# Altium schematic sheet TIDA-PowerNB_BuckBoost.SchDoc
size A3; Date: Not shown in title block; ApprovedBy: Not shown in title block; CheckedBy: Not shown in title block; Author: Not shown in title block; CompanyName: Not shown in title block; DrawnBy: Julian Hagedorn; Engineer: Not shown in title block; Organization: Not shown in title block; Address1: Not shown in title block; Address2: Not shown in title block; Address3: Not shown in title block; Address4: Not shown in title block; DocumentNumber: 1; Revision: Use project parameter SCH_Rev; SheetNumber: 1; SheetTotal: 2; PageSetup: Record=PageOptions|CenterHorizontal=True|CenterVertical=True|PrintScale=1.00|XCorrection=1.00|YCorrection=1.00|PrintKind=0|BorderSize=5000000|LeftOffset=0|BottomOffset=0|Orientation=2|PaperLength=1000|PaperWidth=1000|Scale=100|PaperSource=15|PrintQuality=600|MediaType=1|DitherType=10|PaperKind=Letter|PrintScaleMode=1; CurrentTime: Not shown in title block; CurrentDate: Not shown in title block; Time: Not shown in title block; DocumentFullPathAndName: Not shown in title block; DocumentName: Not shown in title block; ModifiedDate: Not shown in title block; ImagePath: Not shown in title block
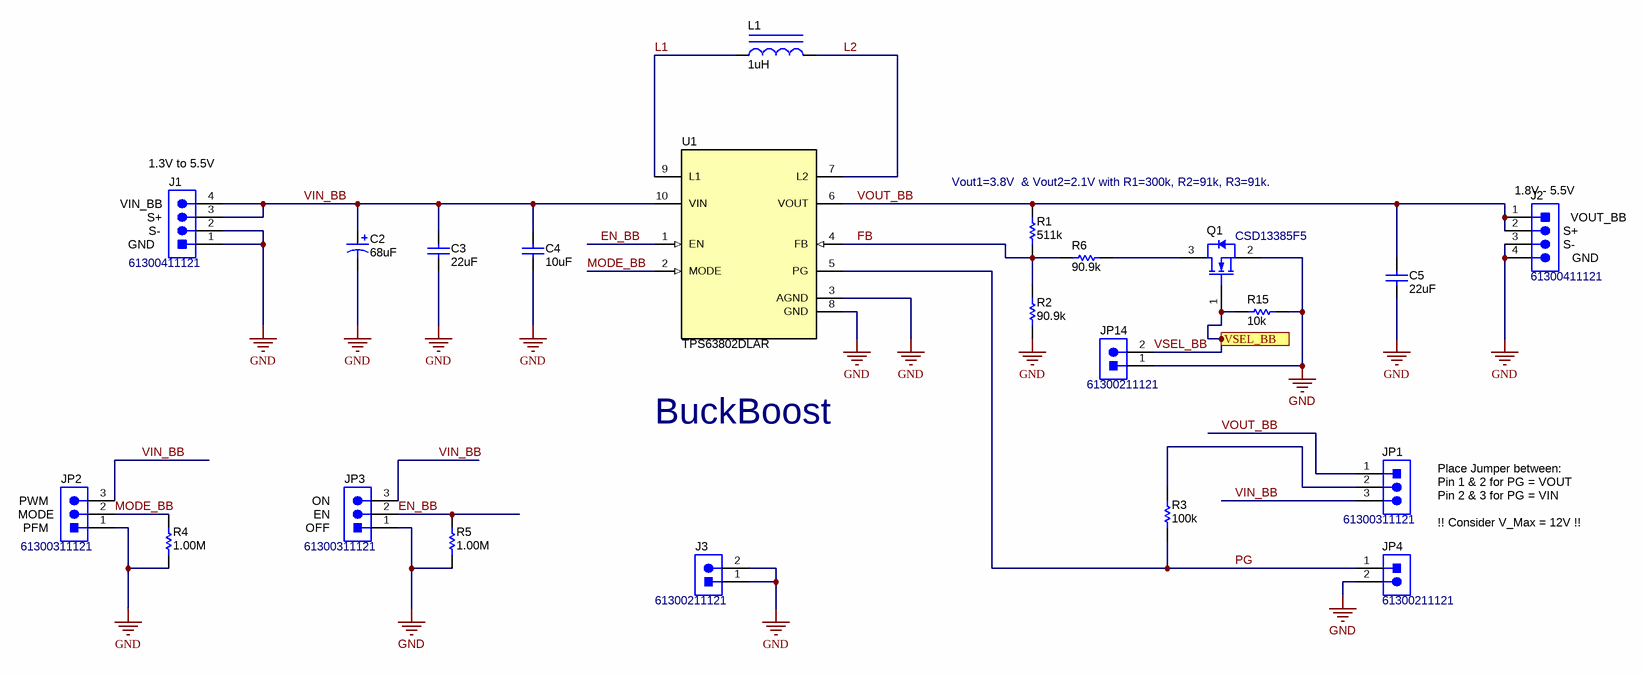
[diagram p0: TIDA-PowerNB_BuckBoost.SchDoc]

## Parts
C2  ValueDisplayed: 68uF  [7343-31]  (hidden comment: Cap_Polarized)
C3  ValueDisplayed: 22uF  [1206_190]  (hidden comment: Capacitor)
C4  ValueDisplayed: 10uF  [0603S]  (hidden comment: Capacitor)
C5  ValueDisplayed: 22uF  [0603S]  (hidden comment: Capacitor)
J1  61300411121  [WURTH_61300411121]
J2  61300411121  [WURTH_61300411121]
J3  61300211121  [WURTH_61300211121]
JP1  61300311121  [WURTH_61300311121]
JP2  61300311121  [WURTH_61300311121]
JP3  61300311121  [WURTH_61300311121]
JP4  61300211121  [WURTH_61300211121]
JP14  61300211121  [WURTH_61300211121]
L1  ValueDisplayed: 1uH  [WE-MAPI_4020]  (hidden comment: 74438356010)
Q1  CSD13385F5  [YJK0003A]
R1  ValueDisplayed: 511k  [0402]  (hidden comment: CRCW0402511KFKED)
R2  ValueDisplayed: 90.9k  [0402]  (hidden comment: CRCW040290K9FKED)
R3  ValueDisplayed: 100k  [0402]  (hidden comment: RC0402FR-07100KL)
R4  ValueDisplayed: 1.00M  [0402]  (hidden comment: CRCW04021M00FKED)
R5  ValueDisplayed: 1.00M  [0402]  (hidden comment: CRCW04021M00FKED)
R6  ValueDisplayed: 90.9k  [0402]  (hidden comment: CRCW040290K9FKED)
R15  Res_ohm: 10k  [0402]  (hidden comment: ERJ-2RKF1002X)
U1  TPS63802DLAR  [DLA0010A]

## Ports
VSEL_BB

## Nets
GND: C2.2(-) C3.2 C4.2 C5.2 J1.1 J1.2 J2.3 J2.4 J3.1 J3.2 JP2.1 JP3.1 JP4.2 JP14.1 Q1.2(S) R2.1 R4.1 R5.1 R15.1 U1.3(AGND) U1.8(GND)
EN_BB: JP3.2 R5.2 U1.1(EN)
FB: R1.1 R2.2 R6.2 U1.4(FB)
L1: L1.1 U1.9(L1)
L2: L1.2 U1.7(L2)
MODE_BB: JP2.2 R4.2 U1.2(MODE)
PG: JP4.1 R3.1 U1.5(PG)
VIN_BB: C2.1(+) C3.1 C4.1 J1.3 J1.4 JP1.3 JP2.3 JP3.3 U1.10(VIN)
VOUT_BB: C5.1 J2.1 J2.2 JP1.1 R1.2 U1.6(VOUT)
VSEL_BB: JP14.2 Q1.1(G) R15.2 ; port VSEL_BB
NetJP1_2: JP1.2 R3.2
NetQ1_3: Q1.3(D) R6.1

## Notes on the sheet
- (near J1) 1.3V to 5.5V
- (near J1) VIN_BB
- (near J1) S+
- (near J1) S-
- (near R1) Vout1=3.8V  & Vout2=2.1V with R1=300k, R2=91k, R3=91k.
- (near J2) 1.8V - 5.5V
- (near J2) S+
- (near J2) VOUT_BB
- (near J1) GND
- (near J2) S-
- (near J2) GND
- BuckBoost
- (near JP2) PWM
- (near JP3) ON
- (near JP2) PFM
- (near JP2) MODE
- (near JP3) OFF
- (near JP3) EN
- Place Jumper between:
  Pin 1 & 2 for PG = VOUT
  Pin 2 & 3 for PG = VIN
  !! Consider V_Max = 12V !!
- Drawn By:
- SVN Rev:
- Number:
- TID #:
- Orderable:
- Rev:
- Sheet Title:
- File:
- Project Title:
- Designed for:
- Assembly Variant:
- Mod. Date:
- Sheet:
- Size:
- of
- A3
- http://www.ti.com
- Texas Instruments and/or its licensors do not warrant the accuracy or completeness of this specification or any information contained therein. Texas Instruments and/or its licensors do not warrant that this design will meet the specifications, will be suitable for your application or fit for any particular purpose, or will operate in an implementation. Texas Instruments and/or its licensors do not warrant that the design is production worthy. You should completely validate and test your design implementation to confirm the system functionality for your application.
- Engineer:
- Contact:
- © Texas Instruments

## Library data of the parts
C2 = CMP-0011790-2: CAP, TA, 68 uF, 20 V, +/- 10%, 0.15 ohm, SMD; PartNumber: T495D686K020ATE150; Manufacturer: Kemet; Polarized: Y; CompType: Capacitor; Value: 68uF; U/M: EA; Cap_F: 68µF; VDC_V: 20V; ESR_ohm: 1.5d; IRMS_A: 9dA; TaMin_C: -55°C; TaMax_C: 125°C; Cap_Case: D; AEC Category: Q200; SizeArea_mm2: 31.39; SizeAreaWB_mm2: 58.59; SizeX_mm: 7.3; SizeY_mm: 4.3; SizeZ_mm: 3.1; PackageReference: 7343-31; RoHS: Y; Tolerance_%: 10%; Value1: 0.15 ohm; Value2: 20V; MountType: SMT; Technology: TA; Series: T495; Publisher: Texas Instruments; LatestRevisionDate: 2017-03-09; LatestRevisionNote: Updated supplier links; ComponentLink1Description: Datasheet link; ComponentLink1URL: http://www.kemet.com/Lists/ProductCatalog/Attachments/261/KEM_T2009_T495.pdf; Supplier 1: Digi-Key; Supplier Part Number 1: 399-3890-1-ND; Supplier 2: Newark; Supplier Part Number 2: 40K1101; Supplier 3: Mouser; Supplier Part Number 3: 80-T495D686K20ATE150; AEC Qualified: ?
C3 = CMP-0009024-2: CAP, CERM, 22 uF, 25 V, +/- 20%, X5R, 1206_190; PartNumber: TMK316BBJ226ML-T; Manufacturer: Taiyo Yuden; Polarized: N; Value: 22uF; U/M: EA; Cap_F: 22µF; Value1: Unknown; VDC_V: 25V; TaMin_C: -55°C; TaMax_C: 85°C; Cap_Case: 1206; AEC Category: Q200; SizeArea_mm2: 5.12; SizeAreaWB_mm2: 10.92; SizeX_mm: 3.2; SizeY_mm: 1.6; SizeZ_mm: 1.9; CompType: Capacitor; PackageReference: 1206_190; RoHS: Y; Tolerance_%: 20%; Value2: 25V; MountType: SMT; Technology: Ceramic; TempCo: X5R; Published: 2008-06-19; Publisher: Texas Instruments; LatestRevisionDate: 2017-03-09; ComponentLink1Description: Datasheet link; ComponentLink1URL: http://www.yuden.co.jp/productdata/catalog/en/mlcc_all_e.pdf; Supplier 1: Digi-Key; Supplier Part Number 1: 587-3246-1-ND; Supplier 2: Newark; Supplier Part Number 2: 29X1397; Supplier 3: Mouser; Supplier Part Number 3: 963-TMK316BBJ226ML-T; AEC Grade: N/A; AEC Qualified: N
C4 = CMP-0007304-5: CAP, CERM, 10 uF, 6.3 V, +/- 20%, X5R, 0603; PartNumber: GRM188R60J106ME84; Manufacturer: MuRata; Polarized: N; Value: 10uF; U/M: EA; Cap_F: 10µF; Value1: Unknown; VDC_V: 6.3V; TaMin_C: -55°C; TaMax_C: 85°C; Cap_Case: 0603; SizeArea_mm2: 1.28; SizeAreaWB_mm2: 4.68; SizeX_mm: 1.6; SizeY_mm: 0.8; SizeZ_mm: 1; AEC Category: Q200; CompType: Capacitor; PackageReference: 0603; RoHS: Y; Tolerance_%: 20%; Value2: 6.3V; MountType: SMT; Technology: Ceramic; TempCo: X5R; Published: 2008-06-19; Publisher: Texas Instruments; LatestRevisionDate: 2017-03-09; ComponentLink1Description: Datasheet link; ComponentLink1URL: http://search.murata.co.jp/Ceramy/image/img/A01X/G101/ENG/GRM188R60J106ME84-01.pdf; Supplier 1: Digi-Key; Supplier Part Number 1: 490-7316-1-ND; AEC Qualified: ?
C5 = CMP-0007306-5: CAP, CERM, 22 uF, 6.3 V, +/- 20%, X5R, 0603; PartNumber: GRM188R60J226MEA0D; Manufacturer: MuRata; Polarized: N; Value: 22uF; U/M: EA; Cap_F: 22µF; Value1: Unknown; VDC_V: 6.3V; TaMin_C: -55°C; TaMax_C: 85°C; Cap_Case: 0603; SizeArea_mm2: 1.28; SizeAreaWB_mm2: 4.68; SizeX_mm: 1.6; SizeY_mm: 0.8; SizeZ_mm: 1; AEC Category: Q200; CompType: Capacitor; PackageReference: 0603; RoHS: Y; Tolerance_%: 20%; Value2: 6.3V; MountType: SMT; Technology: Ceramic; TempCo: X5R; Published: 2008-06-19; Publisher: Texas Instruments; LatestRevisionDate: 2017-03-09; ComponentLink1Description: Datasheet link; ComponentLink1URL: http://search.murata.co.jp/Ceramy/image/img/A01X/G101/ENG/GRM188R60J226MEA0-01.pdf; Supplier 1: Digi-Key; Supplier Part Number 1: 490-7611-1-ND; Supplier 2: Newark; Supplier Part Number 2: 55Y9854; Supplier 3: Mouser; Supplier Part Number 3: 81-GRM188R60J226ME0D; AEC Qualified: N; AEC Grade: N/A
J1 J2 = CMP-0054798-2: Header, 2.54 mm, 4x1, Gold, TH; Manufacturer: Wurth Elektronik; Pitch_mm: 2.54; Gender: Male; Row_Count: 1; Cert_UL: Y; Shrouded: N; Supplier Part Number 3: 2356155; ClassName: Header; MountType: TH; ComponentLink1Description: Datasheet URL; PartNumber: 61300411121; PackageReference: Header, 2.54mm, 4x1, TH; Color: Black; Supplier 3: Farnell; Supplier Part Number 1: 732-5317-ND; Supplier 2: Newark; ComponentLink1URL: http://katalog.we-online.de/em/datasheet/6130xx11121.pdf; CompType: Header; PinCount: 4; Supplier 1: Digi-Key; RoHS: Y; ContactFinish: Gold; Supplier Part Number 2: 20X0951; Orientation: Vertical
J3 JP4 JP14 = CMP-0054794-2: Header, 2.54 mm, 2x1, Gold, TH; Manufacturer: Wurth Elektronik; Shrouded: N; Gender: Male; Green_REACh: Passed; Pitch_mm: 2.54; Green_Lifecycle: Active; Row_Count: 1; Cert_UL: Y; Supplier Part Number 2: 20X0948; Orientation: Vertical; PinCount: 2; ClassName: Header; Supplier 2: Newark; PackageReference: Header, 2.54mm, 2x1, TH; CompType: Header; ComponentLink1Description: Datasheet URL; Supplier 1: Digi-Key; Green_EU RoHS-2: Incomplete; ComponentLink1URL: http://katalog.we-online.de/em/datasheet/6130xx11121.pdf; Green_EU RoHS: Passed; MountType: TH; Supplier Part Number 3: 710-61300211121; RoHS: Y; Supplier Part Number 1: 732-5315-ND; ContactFinish: Gold; Supplier 3: Mouser; PartNumber: 61300211121; Color: Black
JP1-JP3 = CMP-0054796-2: Header, 2.54 mm, 3x1, Gold, TH; Manufacturer: Wurth Elektronik; Pitch_mm: 2.54; Green_Lifecycle: Active; Cert_UL: Y; Shrouded: N; Green_REACh: Passed; Gender: Male; Row_Count: 1; MountType: TH; Supplier Part Number 1: 732-5316-ND; PinCount: 3; Color: Black; ClassName: Header; Supplier Part Number 3: 356154; ContactFinish: Gold; ComponentLink1Description: Datasheet URL; ComponentLink1URL: http://katalog.we-online.de/em/datasheet/6130xx11121.pdf; PackageReference: Header, 2.54mm, 3x1, TH; Supplier Part Number 2: 20X0950; Green_EU RoHS-2: Incomplete; CompType: Header; Green_EU RoHS: Passed; Orientation: Vertical; RoHS: Y; PartNumber: 61300311121; Supplier 2: Newark; Supplier 1: Digi-Key; Supplier 3: Farnell
L1 = CMP-0064168-1: Inductor, Shielded, 1 uH, 7.2 A, 0.012 ohm, SMD; Manufacturer: Wurth Elektronik; Isat: 9A @ 20% inductance drop; Irms: 7.2A @ 40C rise; Green_Lifecycle: Active; SizeAreaWB_mm2: 26.01; DCR_ohm: 0.012; Green_REACh: Passed; Value: 1uH; Imax_A: 7.2A; SizeZ_mm: 2.1; SizeX_mm: 4.1; SizeArea_mm2: 16.81; Ind_H: 1µH; AEC Qualified: N; AEC Category: Q200; ComponentLink1URL: https://sps06.itg.ti.com/sites/KMS/crossdivteams/altium/docs/ComponentDatasheets/74438356010 Wurth.pdf; Publisher: Texas Instruments; Published: 2008-06-26; RoHS: Y; Value1: 0.012 ohm; Material: ?; MountType: SMT; Green_EU RoHS-2: Incomplete; Green_EU RoHS: Passed; PackageReference: 4.1x4.1mm; SizeY_mm: 4.1; Value2: 7.2A; CompType: Inductor; LatestRevisionDate: 2017-06-02; PartNumber: 74438356010; ComponentLink1Description: Datasheet link; AEC Grade: N/A; Technology: Shielded
Q1 = CMP-0080799-1: MOSFET, N-CH, 12 V, 4.3 A, YJK0003A (PICOSTAR-3); Alternate Manufacturer: None; Manufacturer: Texas Instruments; Rdson45_ohm: 0.019; QgTyp_nC: 3.9; SizeAreaWB_mm2: 4.3077; Vgs_V: 8V; Value1: 0.019 ohm; VdsMax_V: 12V; Value: 12V; IdsMax_A: 4.3A; SizeZ_mm: 0.35; SizeX_mm: 1.49; SizeY_mm: 0.73; Value2: 3.9 nC; SizeArea_mm2: 1.0877; ChType: N; AEC Category: Q101; ComponentLink1URL: http://www.ti.com/lit/ds/symlink/csd13385f5.pdf; Supplier Part Number 2: 595-CSD13385F5; Supplier 2: Mouser; RoHS: Y; MountType: SMT; Supplier 1: Digi-Key; PackageReference: YJK0003A; CompType: MOSFET; PartNumber: CSD13385F5; AEC Qualified: N; ComponentLink1Description: Datasheet link; Supplier Part Number 1: 296-47751-1-ND
R1 = CMP-0026435-2: RES, 511 k, 1%, 0.063 W, AEC-Q200 Grade 0, 0402; Manufacturer: Vishay-Dale; Power_W: 63mW; TempCo: 100 ppm/C; Value: 511k; EIA_Code: E96; SizeX_mm: 1; SizeY_mm: 0.5; SizeZ_mm: 0.6; Value2: 0.063W; AEC Qualified: Y; VDC_V: 50V; AEC Category: Q200; AEC Grade: 0; ComponentLink1URL: http://www.vishay.com/docs/20035/dcrcwe3.pdf; Supplier Part Number 2: 52K7134; Supplier 2: Newark; Supplier Part Number 3: 71-CRCW0402-511K-E3; Supplier 3: Mouser; Value_Code: 511k; RoHS: E; Value1: 1%; MountType: SMT; Supplier 1: Digi-Key; PackageReference: 0402; Tolerance_%: 1%; Res_ohm: 511k; SizeArea_mm2: 0.5; CompType: Resistor; PartNumber: CRCW0402511KFKED; ComponentLink1Description: Datasheet link; Supplier Part Number 1: 541-511KLCT-ND; Technology: Thick Film
R2 R6 = CMP-0026605-2: RES, 90.9 k, 1%, 0.063 W, AEC-Q200 Grade 0, 0402; Manufacturer: Vishay-Dale; Power_W: 63mW; TempCo: 100 ppm/C; Value_Code: 90k9; Value: 90.9k; EIA_Code: E96; SizeX_mm: 1; SizeY_mm: 0.5; SizeZ_mm: 0.6; Value2: 0.063W; AEC Qualified: Y; VDC_V: 50V; AEC Category: Q200; AEC Grade: 0; ComponentLink1URL: http://www.vishay.com/docs/20035/dcrcwe3.pdf; Supplier Part Number 2: 52K7338; Supplier 2: Newark; Supplier Part Number 3: 71-CRCW0402-90.9K-E3; Supplier 3: Mouser; RoHS: E; Value1: 1%; MountType: SMT; Supplier 1: Digi-Key; PackageReference: 0402; Tolerance_%: 1%; Res_ohm: 90.9k; SizeArea_mm2: 0.5; CompType: Resistor; PartNumber: CRCW040290K9FKED; ComponentLink1Description: Datasheet link; Supplier Part Number 1: 541-90.9KLCT-ND; Technology: Thick Film
R3 = CMP-0026721-1: RES, 100 k, 1%, 0.0625 W, 0402; Manufacturer: Yageo America; Power_W: 62.5mW; TempCo: 100 ppm/C; U/M: EA; Value: 100k; EIA_Code: E96; SizeX_mm: 1; SizeY_mm: 0.5; SizeZ_mm: 0.6; AEC Qualified: N; VDC_V: 50V; AEC Category: Q200; ComponentLink1URL: http://www.yageo.com/documents/recent/PYu-RC0402_51_RoHS_L_6_r.pdf; Supplier Part Number 2: 67R9887; Publisher: Texas Instruments; Supplier 2: Newark; Supplier Part Number 3: 603-RC0402FR-07100KL; Supplier 3: Mouser; Published: 2008-06-26; Value_Code: 100k; RoHS: Y; Value1: 1%; MountType: SMT; Supplier 1: Digi-Key; PackageReference: 0402; Tolerance_%: 1%; Res_ohm: 100k; Value2: 0.0625W; SizeArea_mm2: 0.5; CompType: Resistor; LatestRevisionDate: 2017-03-09; PartNumber: RC0402FR-07100KL; ComponentLink1Description: Datasheet link; AEC Grade: N/A; Supplier Part Number 1: 311-100KLRCT-ND; Technology: Thick Film
R4 R5 = CMP-0026100-2: RES, 1.00 M, 1%, 0.063 W, AEC-Q200 Grade 0, 0402; Manufacturer: Vishay-Dale; Power_W: 63mW; TempCo: 100 ppm/C; Value_Code: 1M00; Value: 1.00Meg; EIA_Code: E96; Res_ohm: 1M; SizeX_mm: 1; SizeY_mm: 0.5; SizeZ_mm: 0.6; Value2: 0.063W; AEC Qualified: Y; VDC_V: 50V; AEC Category: Q200; AEC Grade: 0; ComponentLink1URL: http://www.vishay.com/docs/20035/dcrcwe3.pdf; Supplier Part Number 2: 52K6593; Supplier 2: Newark; Supplier Part Number 3: 71-CRCW0402-1.0M-E3; Supplier 3: Mouser; RoHS: E; Value1: 1%; MountType: SMT; Supplier 1: Digi-Key; PackageReference: 0402; Tolerance_%: 1%; SizeArea_mm2: 0.5; CompType: Resistor; PartNumber: CRCW04021M00FKED; ComponentLink1Description: Datasheet link; Supplier Part Number 1: 541-1.00MLCT-ND; Technology: Thick Film
R15 = CMP-0026658-1: RES, 10.0 k, 1%, 0.1 W, 0402; Manufacturer: Panasonic; Power_W: 100mW; TempCo: 100 ppm/C; Value_Code: 10k0; U/M: EA; Value: 10.0k; EIA_Code: E96; SizeX_mm: 1; SizeY_mm: 0.5; SizeZ_mm: 0.6; Value2: 0.1W; CompType: Resistor; VDC_V: 50V; AEC Category: Q200; ComponentLink1URL: http://industrial.panasonic.com/www-data/pdf/AOA0000/AOA0000CE2.pdf; Supplier Part Number 2: 90W2949; Publisher: Texas Instruments; Supplier 2: Newark; Supplier Part Number 3: 667-ERJ-2RKF1002X; Supplier 3: Mouser; Published: 2008-06-26; RoHS: Y; Value1: 1%; MountType: SMT; Supplier 1: Digi-Key; PackageReference: 0402; Tolerance_%: 1%; SizeArea_mm2: 0.5; LatestRevisionDate: 2017-03-09; PartNumber: ERJ-2RKF1002X; AEC Qualified: ?; ComponentLink1Description: Datasheet link; Supplier Part Number 1: P10.0KLCT-ND; Technology: Thick Film; ValueDisplayed: 10.0k
U1 = CMP-0076712-3: High Current, High Efficiency Single Inductor Buck-Boost Converter, DLA0010A (VQFN-HR-10); Manufacturer: Texas Instruments; Alternate PartNumber: TPS63802DLAT; SizeX_mm: 2.0; SizeY_mm: 3.0; CompType: IC; SizeZ_mm: 1.0; SizeArea_mm2: 6.0; SizeAreaWB_mm2: 12.0; U/M: EA; PackageDescription: VQFN-HR-10; PartNumber: TPS63802DLAR; ComponentLink1URL: https://sps06.itg.ti.com/sites/KMS/crossdivteams/altium/docs/ComponentDatasheets/TPS63802_pinout.PNG; ComponentLink1Description: Datasheet Link; LatestRevisionDate: 2017-07-18; Publisher: Texas Instruments; PackageReference: DLA0010A; MountType: SMT; Alternate Manufacturer: Texas Instruments